# Altium schematic sheet AMP.SchDoc
size A
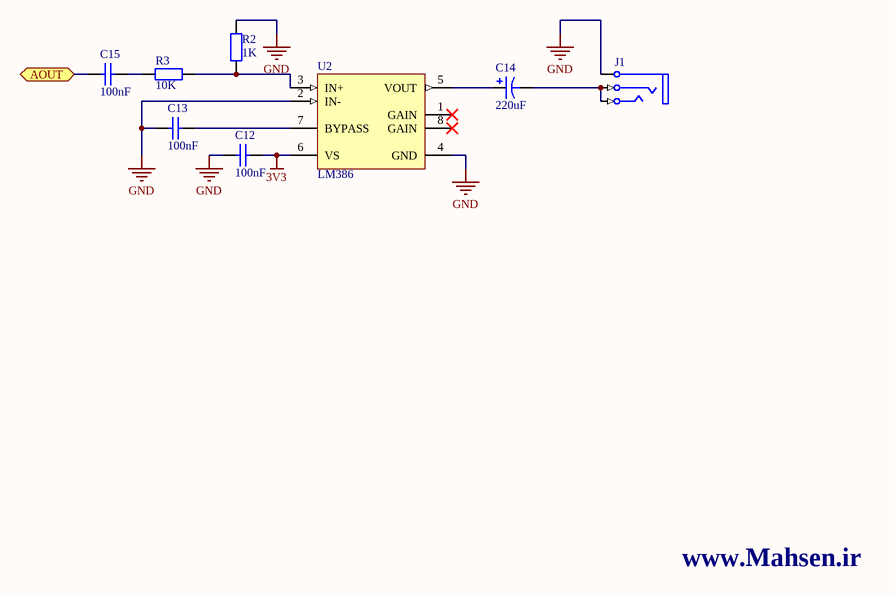
[diagram p0: AMP.SchDoc]

## Parts
C12  100nF  [0805]
C13  100nF  [0805]
C14  220uF  [C0805]
C15  100nF  [0805]
J1  Phonejack3  [JACK/6-V3]  (value not drawn)
R2  1K  [0805]
R3  10K  [0805]
U2  LM386  [M08A_L]

## Ports
AOUT (bidir)

## Nets
3V3: C12.1 U2.6(VS)
GND: C12.2 C13.2 J1.5(S) R2.2 U2.2(IN-) U2.4(GND)
AOUT: C15.2 ; port AOUT
NetC13_1: C13.1 U2.7(BYPASS)
NetC14_1: C14.1 U2.5(VOUT)
NetC14_2: C14.2 J1.1(T) J1.3(R)
NetC15_1: C15.1 R3.1
NetR2_1: R2.1 R3.2 U2.3(IN+)

Not connected (* = marked no-connect by the designer): U2 1(GAIN)* 8(GAIN)*

## Notes on the sheet
- www.Mahsen.ir

## Library data of the parts
C12 C13 C15 = Cap: Capacitor; Published: 8-Jun-2000; LatestRevisionDate: 17-Jul-2002; LatestRevisionNote: Re-released for DXP Platform.; PackageReference: RAD-0.3; Publisher: Altium Limited; PackageDescription: Radial Cap, Thru-Hole; 2 Leads; 0.3 in Pin Spacing; Value: 100nF
C14 = Cap Pol3: Polarized Capacitor (Surface Mount); Published: 8-Jun-2000; LatestRevisionDate: 29-May-2009; LatestRevisionNote: IPC-7351 Footprint Added.; PackageReference: C0805; Publisher: Altium Limited; PackageDescription: Chip Capacitor; Value: 220uF
J1 = Phonejack3: Jack Socket, 1/4" [6.5mm], Thru-Hole, Vertical, 3-Conductor Open Circuit (Non-Normalling); PackageDocument: 2003; PCB_Layout: Complies with manufacturer's recommendation.; DrillAndSlotSize: Corresponds to nominal value.; Published: 15-Jul-2004; LatestRevisionDate: 15-Jul-2004; LatestRevisionNote: Component Replaced.; DatasheetDocument: 2003; PackageReference: S1VS_SSS; Publisher: Altium Limited; ComponentLink1Description: Manufacturer Link; ComponentLink1URL: http://www.cliffuk.co.uk/
R2 R3 = Res2: Resistor; Published: 8-Jun-2000; LatestRevisionDate: 17-Jul-2002; LatestRevisionNote: Re-released for DXP Platform.; PackageReference: AXIAL-0.4; Publisher: Altium Limited; PackageDescription: Axial Device, Thru-Hole; 2 Leads; 0.4 in Pin Spacing
  R2: Value: 1K
  R3: Value: 10K
U2 = LM386MX-1: Low Voltage Audio Power Amplifier, 8-pin Narrow SOIC; Manufacturer: National Semiconductor; PackageTopMarking: NSZXTT*LM386*M-1; PowerWise: N; CompType: Audio IC; Published: 1-Mar-2010; DatasheetVersion: Aug-2000; PackageVersion: revM, May-2009; PackageReference: M08A; Publisher: Altium Limited; PackageDescription: SOIC Narrow, 4.9 x 3.9 x 1.45mm, 8 Lead, 1.27mm Pitch; PartNumber: LM386MX-1; RoHS: N; PinCount: 8; Code_JEDEC: MS-012-AA; Code_IPC: SOIC127P600-8; ComponentLink1Description: LM386 Datasheet; ComponentLink1URL: http://www.national.com/ds/LM/LM386.pdf; ComponentLink2Description: LM386 Web Page; ComponentLink2URL: http://www.national.com/pf/LM/LM386.html; ComponentLink3Description: M08A Package Page; ComponentLink3URL: http://www.national.com/packaging/folders/m08a.html